# EAGLE design ESP-12 4-relay board USB power (EAGLE 9.6.2)

## Sheet 1 of 3
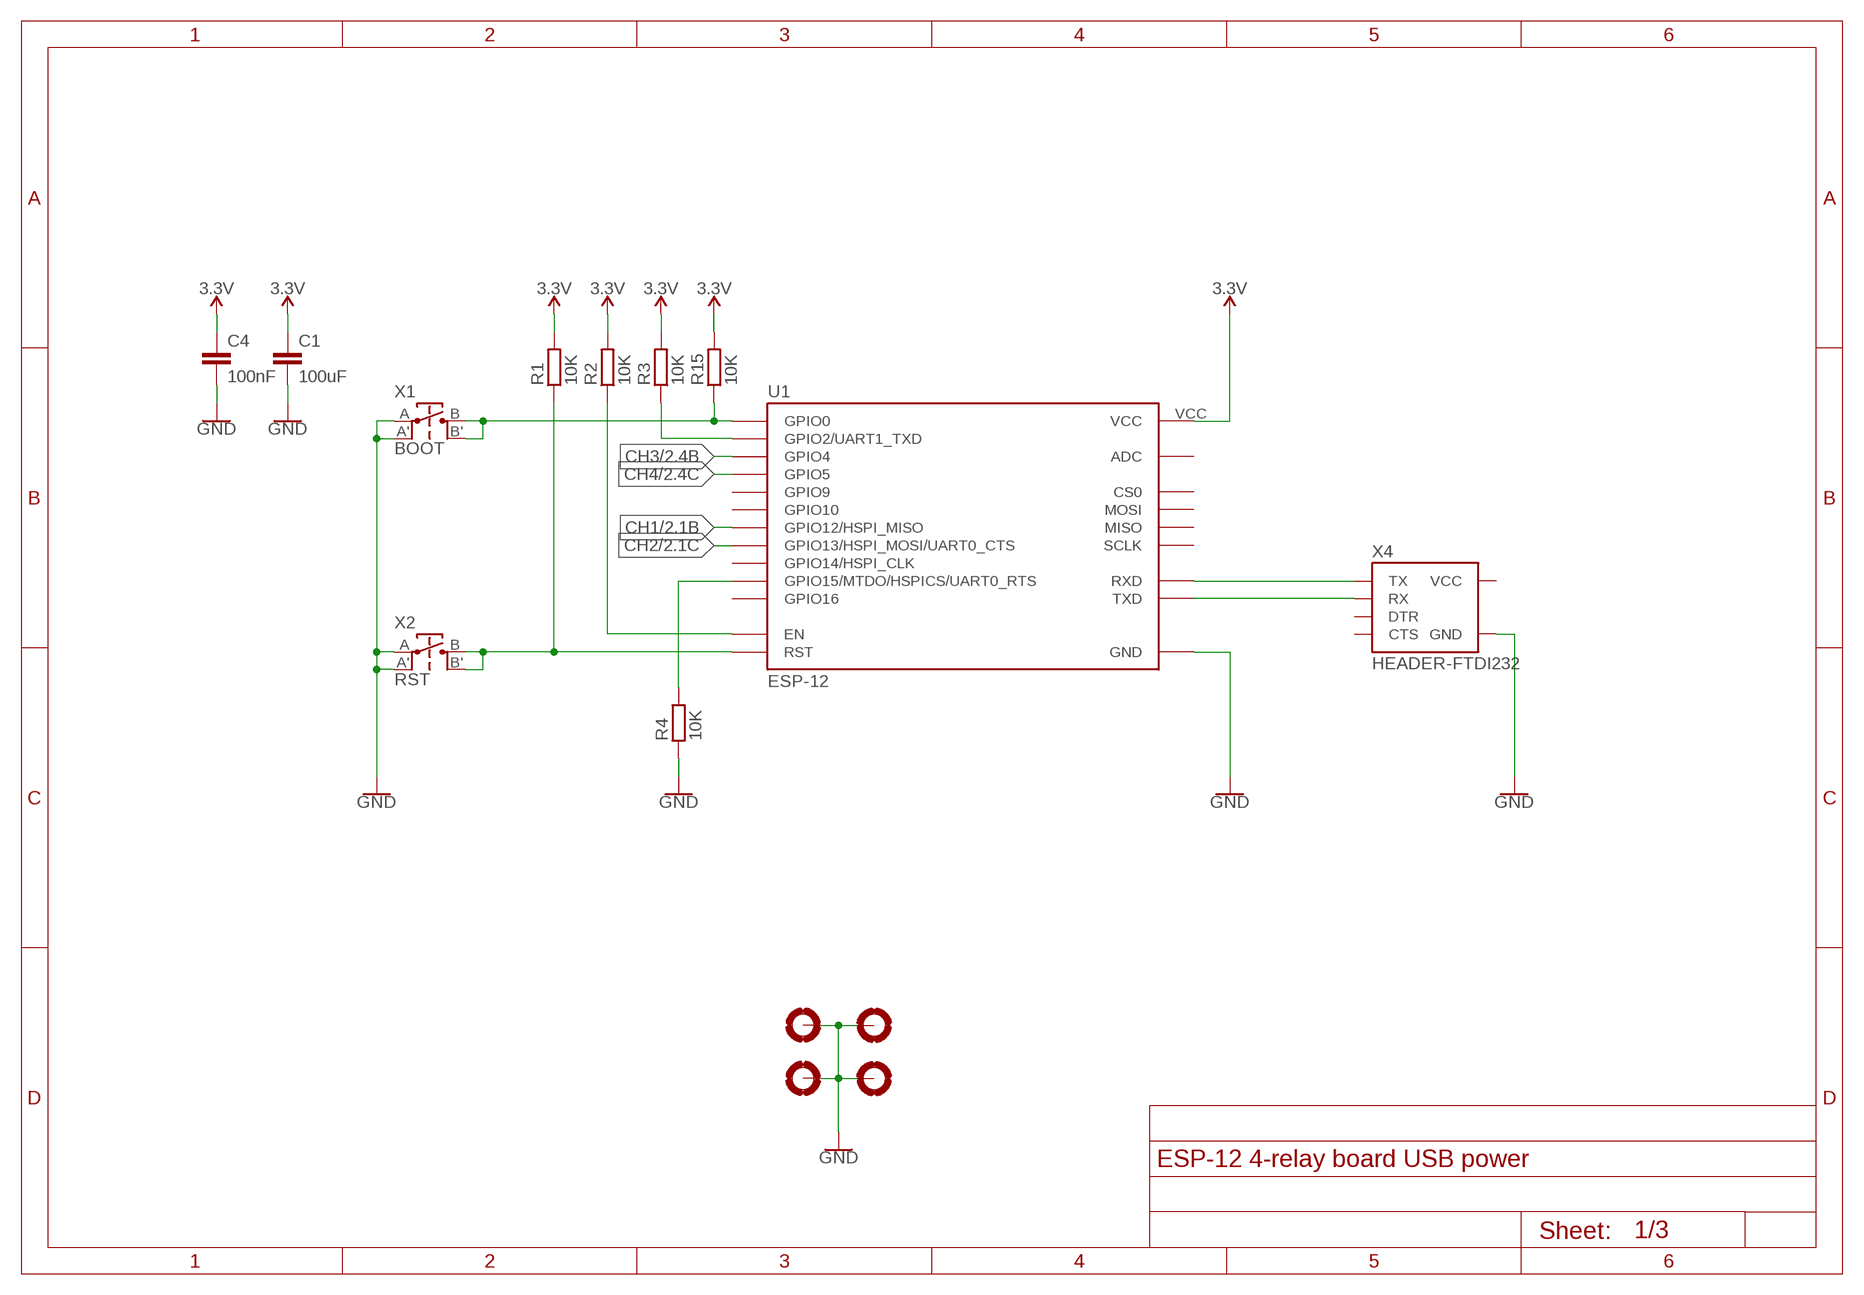
[diagram p0: schematic, sheet 1]

### Parts
C1  100uF  CAPC0603  [C0603]
C4  100nF  CAPC0603  [C0603]
H1  MOUNTHOLE-PAD3.2  [3.2-PAD]
H2  MOUNTHOLE-PAD3.2  [3.2-PAD]
H3  MOUNTHOLE-PAD3.2  [3.2-PAD]
H4  MOUNTHOLE-PAD3.2  [3.2-PAD]
R1  10K  RESISTOR0603  [R0603]
R2  10K  RESISTOR0603  [R0603]
R3  10K  RESISTOR0603  [R0603]
R4  10K  RESISTOR0603  [R0603]
R15  10K  RESISTOR0603  [R0603]
U1  ESP-12  ESP-12E  [ESP-12E]
X1  BOOT  TACT-SWITCHEVQ  [TACT-SWITCH-EVQ]
X2  RST  TACT-SWITCHEVQ  [TACT-SWITCH-EVQ]
X4  HEADER-FTDI232  [FTDI232-1X06]

### Nets
3.3V: C1.1 C4.1 R1.2 R2.2 R3.2 R15.2 U1.VCC ; also sheet 3
CH1: U1.GPIO12(GPIO12/HSPI_MISO) ; also sheet 2
CH2: U1.GPIO13(GPIO13/HSPI_MOSI/UART0_CTS) ; also sheet 2
CH3: U1.GPIO4 ; also sheet 2
CH4: U1.GPIO5 ; also sheet 2
GND: C1.2 C4.2 H1.B3,2(MOUNT) H2.B3,2(MOUNT) H3.B3,2(MOUNT) H4.B3,2(MOUNT) R4.1 U1.GND X1.A X1.A' X2.A X2.A' X4.GND ; also sheet 2,3
N$7: R4.2 U1.GPIO15(GPIO15/MTDO/HSPICS/UART0_RTS)
N$16: R2.1 U1.EN
N$19: R1.1 U1.RST X2.B X2.B'
N$22: R15.1 U1.GPIO0 X1.B X1.B'
N$24: R3.1 U1.GPIO2(GPIO2/UART1_TXD)
RXD: U1.RXD X4.TX
TXD: U1.TXD X4.RX
Unconnected: U1.ADC U1.CS0 U1.GPIO9 U1.GPIO10 U1.GPIO14(GPIO14/HSPI_CLK) U1.GPIO16 U1.MISO U1.MOSI U1.SCLK X4.CTS X4.DTR

## Sheet 2 of 3
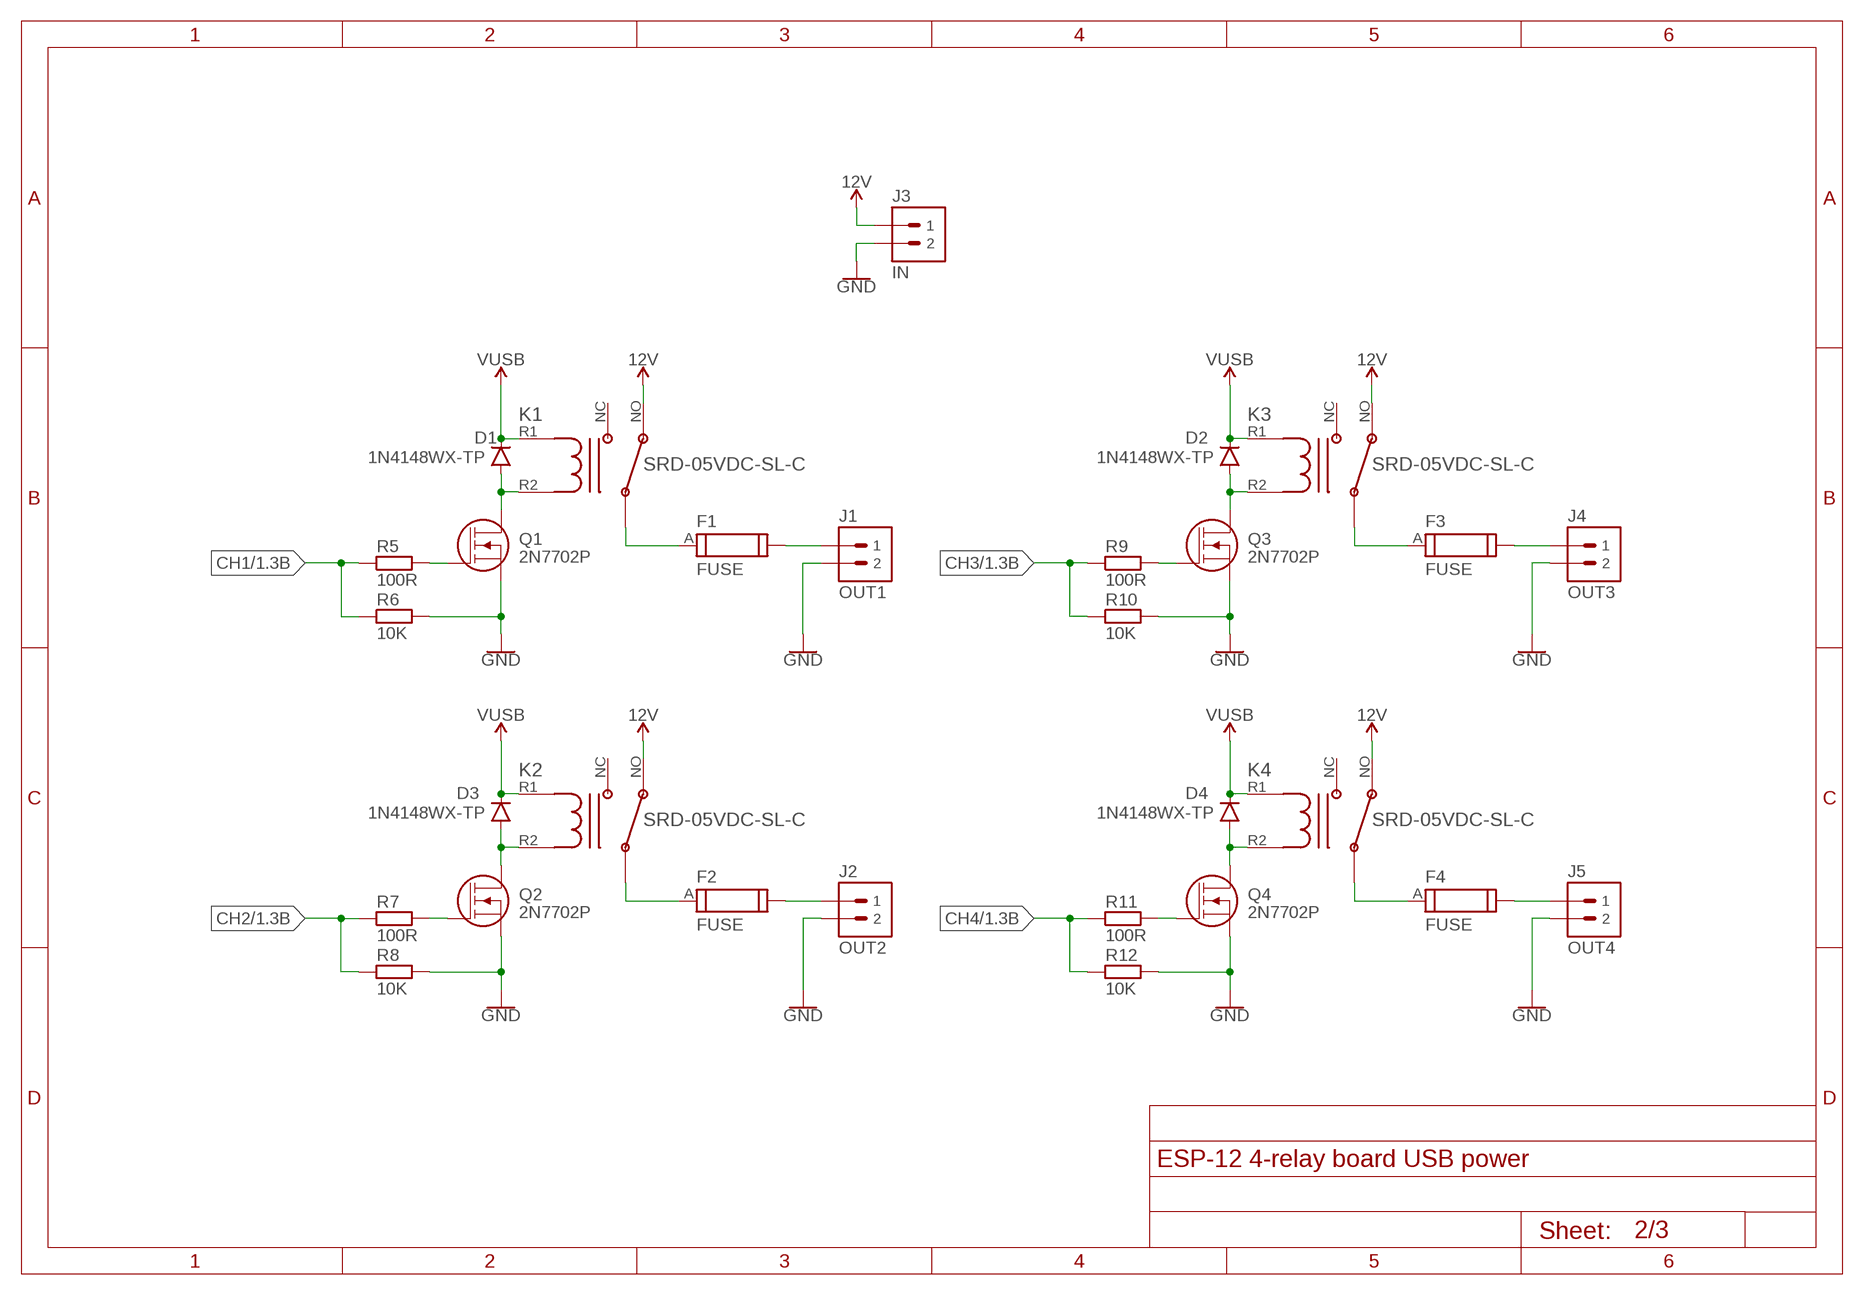
[diagram p1: schematic, sheet 2]

### Parts
D1  1N4148WX-TP  DIODE1N4148WX-TP  [SOD-323]
D2  1N4148WX-TP  DIODE1N4148WX-TP  [SOD-323]
D3  1N4148WX-TP  DIODE1N4148WX-TP  [SOD-323]
D4  1N4148WX-TP  DIODE1N4148WX-TP  [SOD-323]
F1  FUSE  FUSETEAL  [FUSE-TEAL]
F2  FUSE  FUSETEAL  [FUSE-TEAL]
F3  FUSE  FUSETEAL  [FUSE-TEAL]
F4  FUSE  FUSETEAL  [FUSE-TEAL]
J1  OUT1  TERMINAL-1X02-5.08OSTTC022162  [ONSHORE-OSTTC022162]
J2  OUT2  TERMINAL-1X02-5.08OSTTC022162  [ONSHORE-OSTTC022162]
J3  IN  TERMINAL-1X02-5.08OSTTC022162  [ONSHORE-OSTTC022162]
J4  OUT3  TERMINAL-1X02-5.08OSTTC022162  [ONSHORE-OSTTC022162]
J5  OUT4  TERMINAL-1X02-5.08OSTTC022162  [ONSHORE-OSTTC022162]
K1  SRD-05VDC-SL-C  RELAYSRD-05VDC-SL-C  [RELAY-SRD-05VDC-SL-C]
K2  SRD-05VDC-SL-C  RELAYSRD-05VDC-SL-C  [RELAY-SRD-05VDC-SL-C]
K3  SRD-05VDC-SL-C  RELAYSRD-05VDC-SL-C  [RELAY-SRD-05VDC-SL-C]
K4  SRD-05VDC-SL-C  RELAYSRD-05VDC-SL-C  [RELAY-SRD-05VDC-SL-C]
Q1  2N7702P  MOSFET-NCHSOT23-3  [SOT23-3]
Q2  2N7702P  MOSFET-NCHSOT23-3  [SOT23-3]
Q3  2N7702P  MOSFET-NCHSOT23-3  [SOT23-3]
Q4  2N7702P  MOSFET-NCHSOT23-3  [SOT23-3]
R5  100R  RESISTOR0603  [R0603]
R6  10K  RESISTOR0603  [R0603]
R7  100R  RESISTOR0603  [R0603]
R8  10K  RESISTOR0603  [R0603]
R9  100R  RESISTOR0603  [R0603]
R10  10K  RESISTOR0603  [R0603]
R11  100R  RESISTOR0603  [R0603]
R12  10K  RESISTOR0603  [R0603]

### Nets
12V: J3.1 K1.NO(NC) K2.NO(NC) K3.NO(NC) K4.NO(NC)
CH1: R5.1 R6.1 ; also sheet 1
CH2: R7.1 R8.1 ; also sheet 1
CH3: R9.1 R10.1 ; also sheet 1
CH4: R11.1 R12.1 ; also sheet 1
GND: J1.2 J2.2 J3.2 J4.2 J5.2 Q1.2(S) Q2.2(S) Q3.2(S) Q4.2(S) R6.2 R8.2 R10.2 R12.2 ; also sheet 1,3
N$1: D1.2(A) K1.R2 Q1.3(D)
N$2: F1.A K1.C
N$3: F1.B J1.1
N$4: Q1.1(G) R5.2
N$8: D3.2(A) K2.R2 Q2.3(D)
N$9: Q2.1(G) R7.2
N$10: F2.A K2.C
N$11: F2.B J2.1
N$12: D2.2(A) K3.R2 Q3.3(D)
N$13: F3.A K3.C
N$14: F3.B J4.1
N$15: Q3.1(G) R9.2
N$17: D4.2(A) K4.R2 Q4.3(D)
N$18: Q4.1(G) R11.2
N$20: F4.A K4.C
N$21: F4.B J5.1
VUSB: D1.1(C) D2.1(C) D3.1(C) D4.1(C) K1.R1 K2.R1 K3.R1 K4.R1 ; also sheet 3
Unconnected: K1.NC(NO) K2.NC(NO) K3.NC(NO) K4.NC(NO)

## Sheet 3 of 3
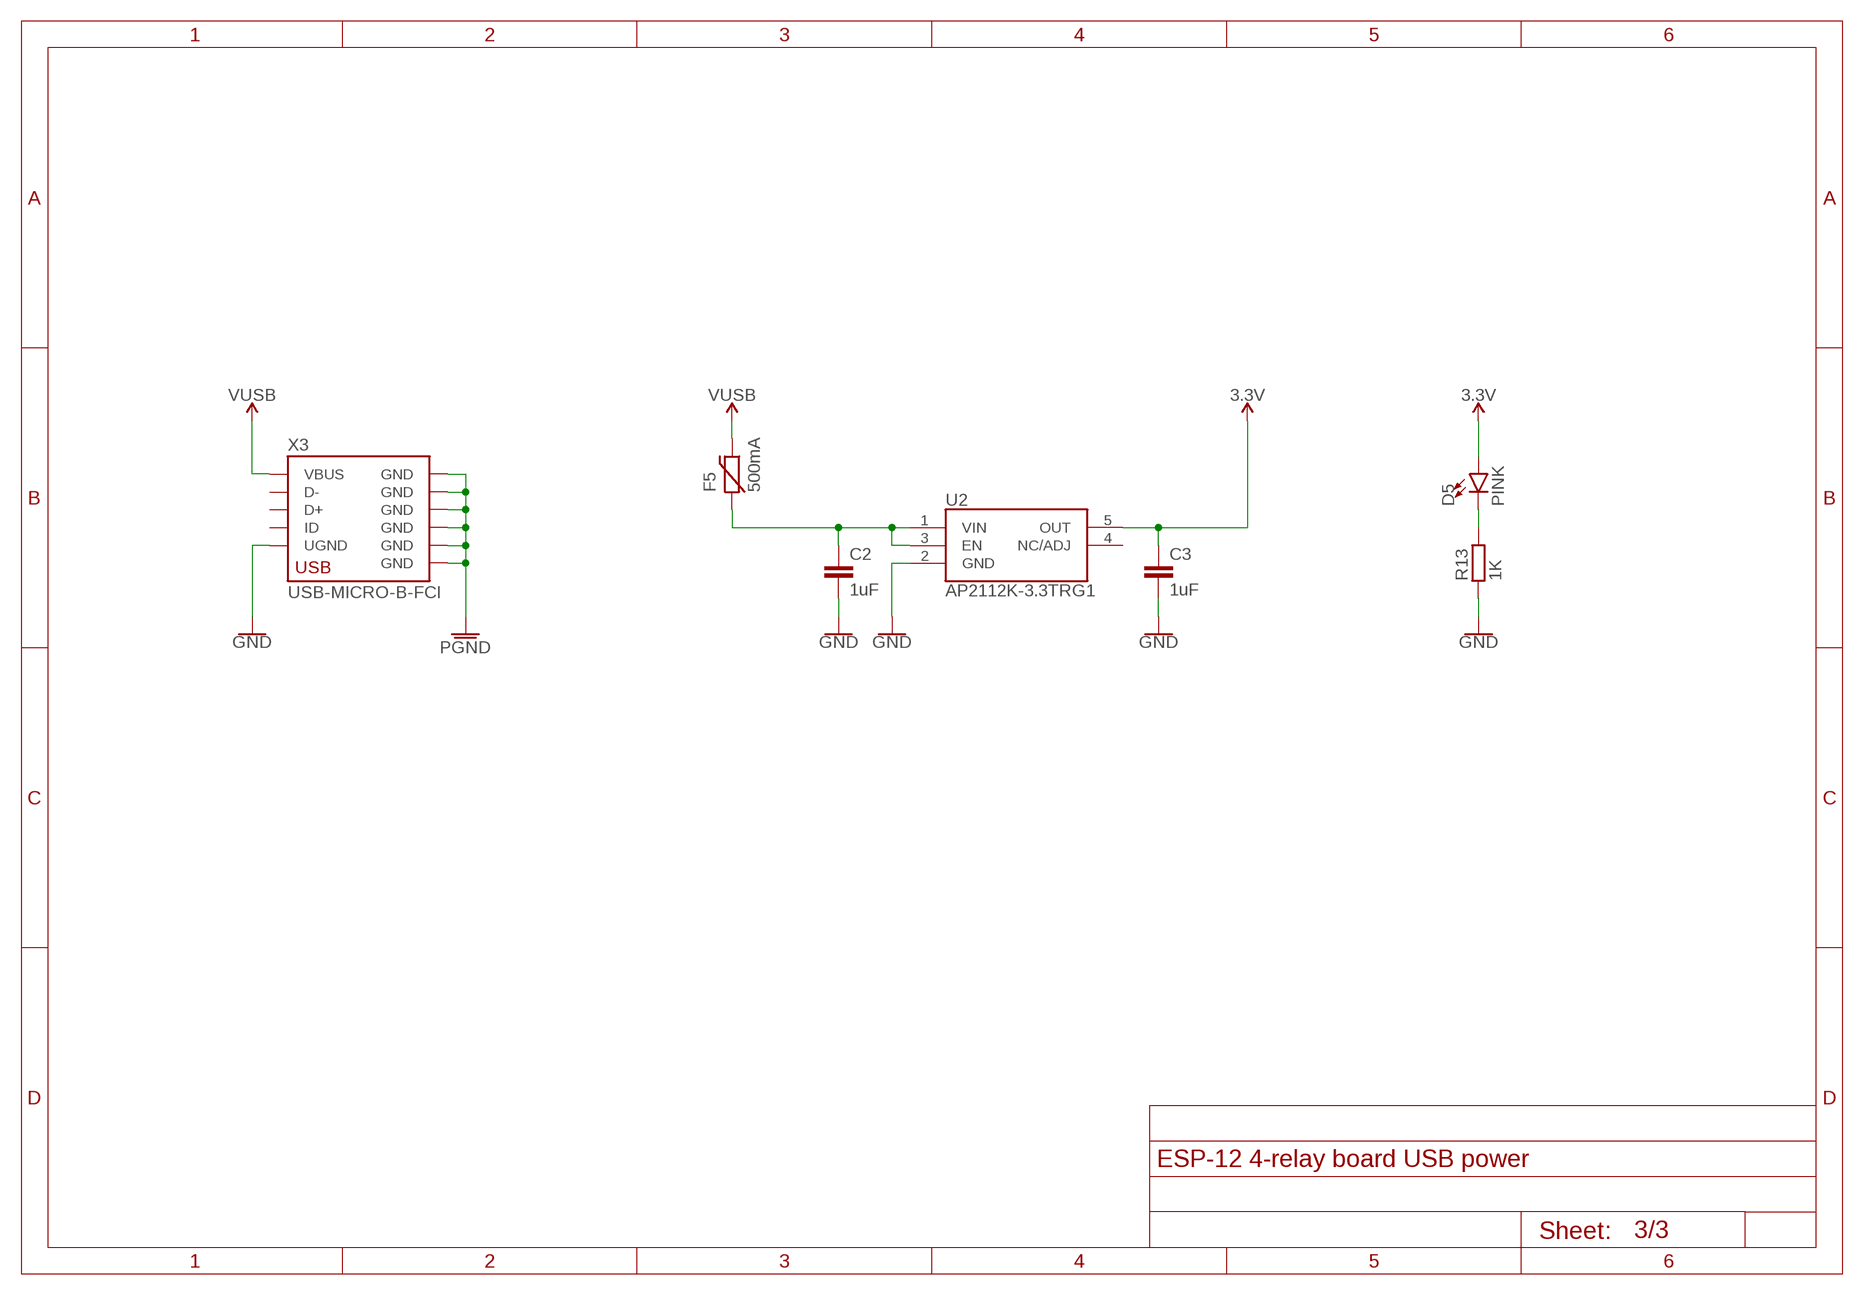
[diagram p2: schematic, sheet 3]

### Parts
C2  1uF  CAPC0603  [C0603]
C3  1uF  CAPC0603  [C0603]
D5  PINK  LED0603  [LED0603]
F5  500mA  PTC0ZCJ  [PTC-0ZCJ-1206]
R13  1K  RESISTOR0603  [R0603]
U2  AP2112K-3.3TRG1  REGULATOR-AP2112KK-SOT23-5  [SOT23-5]
X3  USB-MICRO-B-FCI  [USB-MICRO-B-FCI]

### Nets
3.3V: C3.1 D5.A U2.5(OUT) ; also sheet 1
GND: C2.2 C3.2 R13.1 U2.2(GND) X3.5(UGND) ; also sheet 1,2
N$5: D5.C R13.2
N$6: C2.1 F5.1 U2.1(VIN) U2.3(EN)
PGND: X3.GND@1(GND) X3.GND@2(GND) X3.GND@3(GND) X3.GND@4(GND) X3.GND@5(GND) X3.GND@6(GND)
VUSB: F5.2 X3.1(VBUS) ; also sheet 2
Unconnected: U2.4(NC/ADJ) X3.2(D-) X3.3(D+) X3.4(ID)

## Power pins joined to a net without a drawn wire
VCC: X4.VCC

## Library data of the parts
C1-C4 = M2M-Passives:CAP
D1-D4 = M2M-DiscreteSemi:DIODE
D5 = M2M-LED:LED: LED (Generic) Standard schematic elements and footprints for 5mm, 3mm, 1206, and 0603 sized LEDs. Generic LEDs with no color specified.
F1-F4 = M2M-Power:FUSE
F5 = M2M-Fuse:PTC
H1-H4 = M2M-Holes:MOUNTHOLE-PAD
J1-J5 = M2M-Connectors:TERMINAL-1X02-5.08: https://www.digikey.se/product-detail/sv/on-shore-technology-inc/OSTTC022162/ED2609-ND/614558
K1-K4 = M2M-Switches:RELAY
Q1-Q4 = M2M-DiscreteSemi:MOSFET-NCH
R1-R13 R15 = M2M-Passives:RESISTOR
U1 = M2M-Modules:ESP-12E
U2 = M2M-IC:REGULATOR-AP2112K
X1 X2 = M2M-Switches:TACT-SWITCH
X3 = M2M-Connectors:USB-MICRO-B-FCI: FCI-10118192-0001LF 609-4613-1-ND
X4 = M2M-Connectors:HEADER-FTDI232

## Board
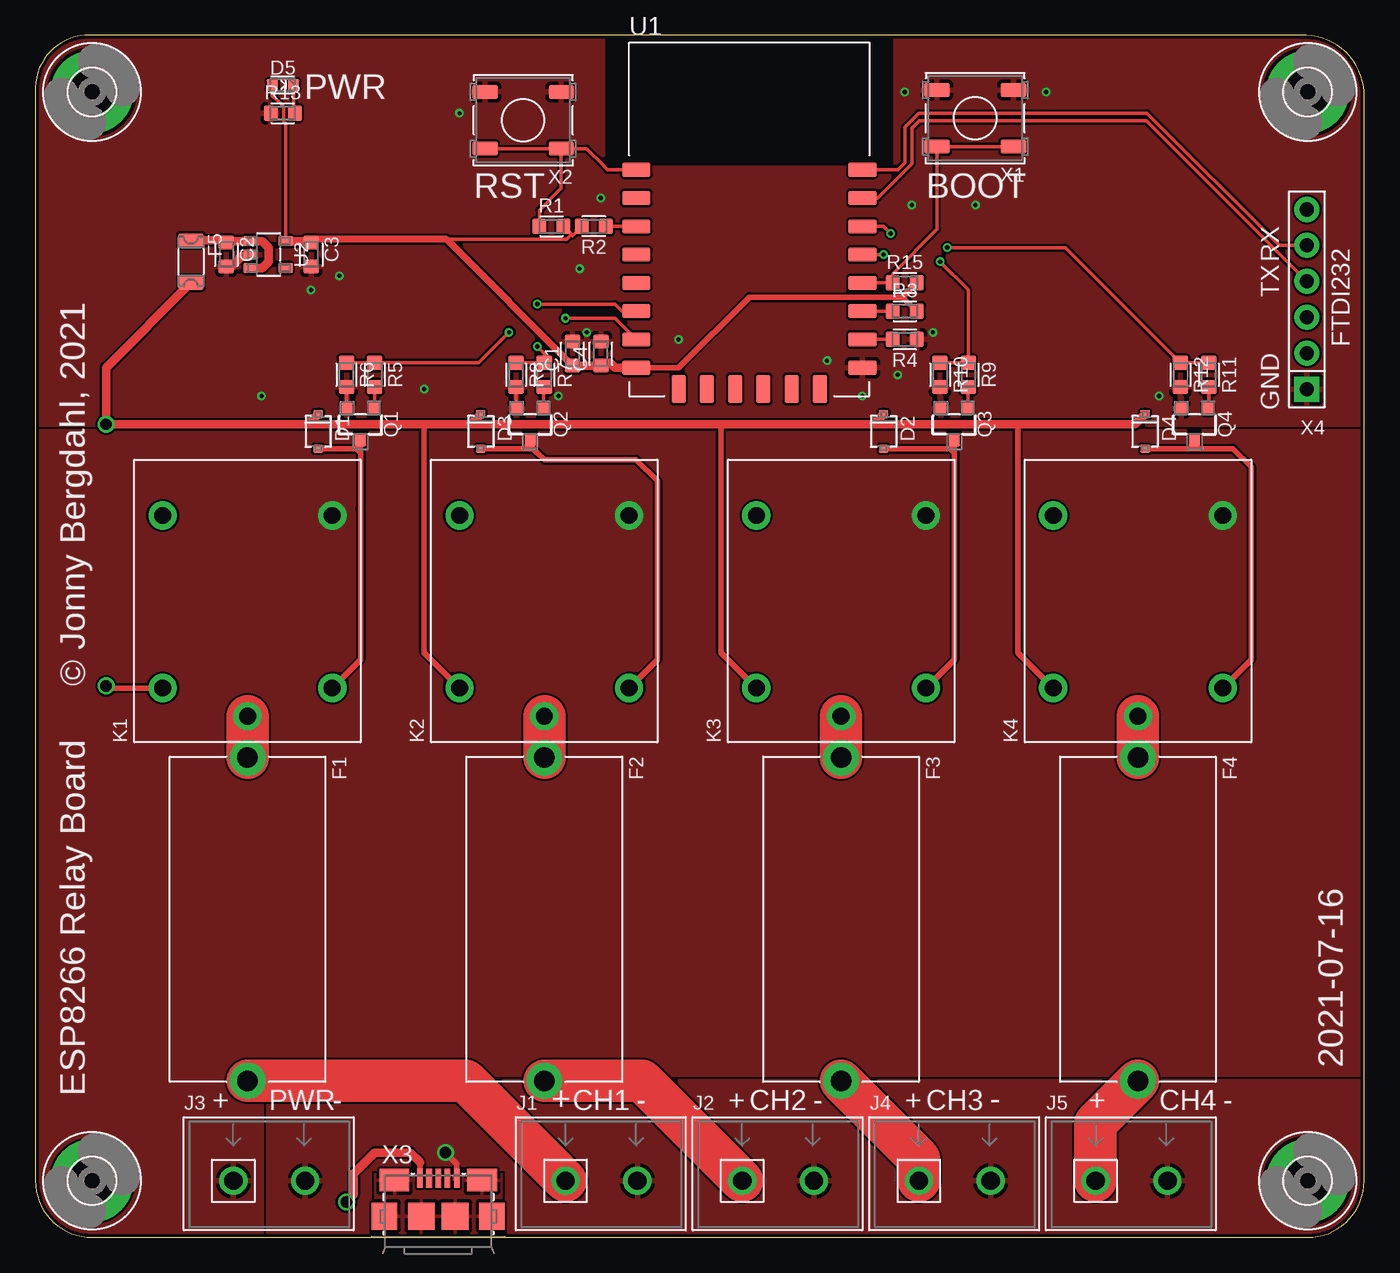
[diagram p3: board, top side]
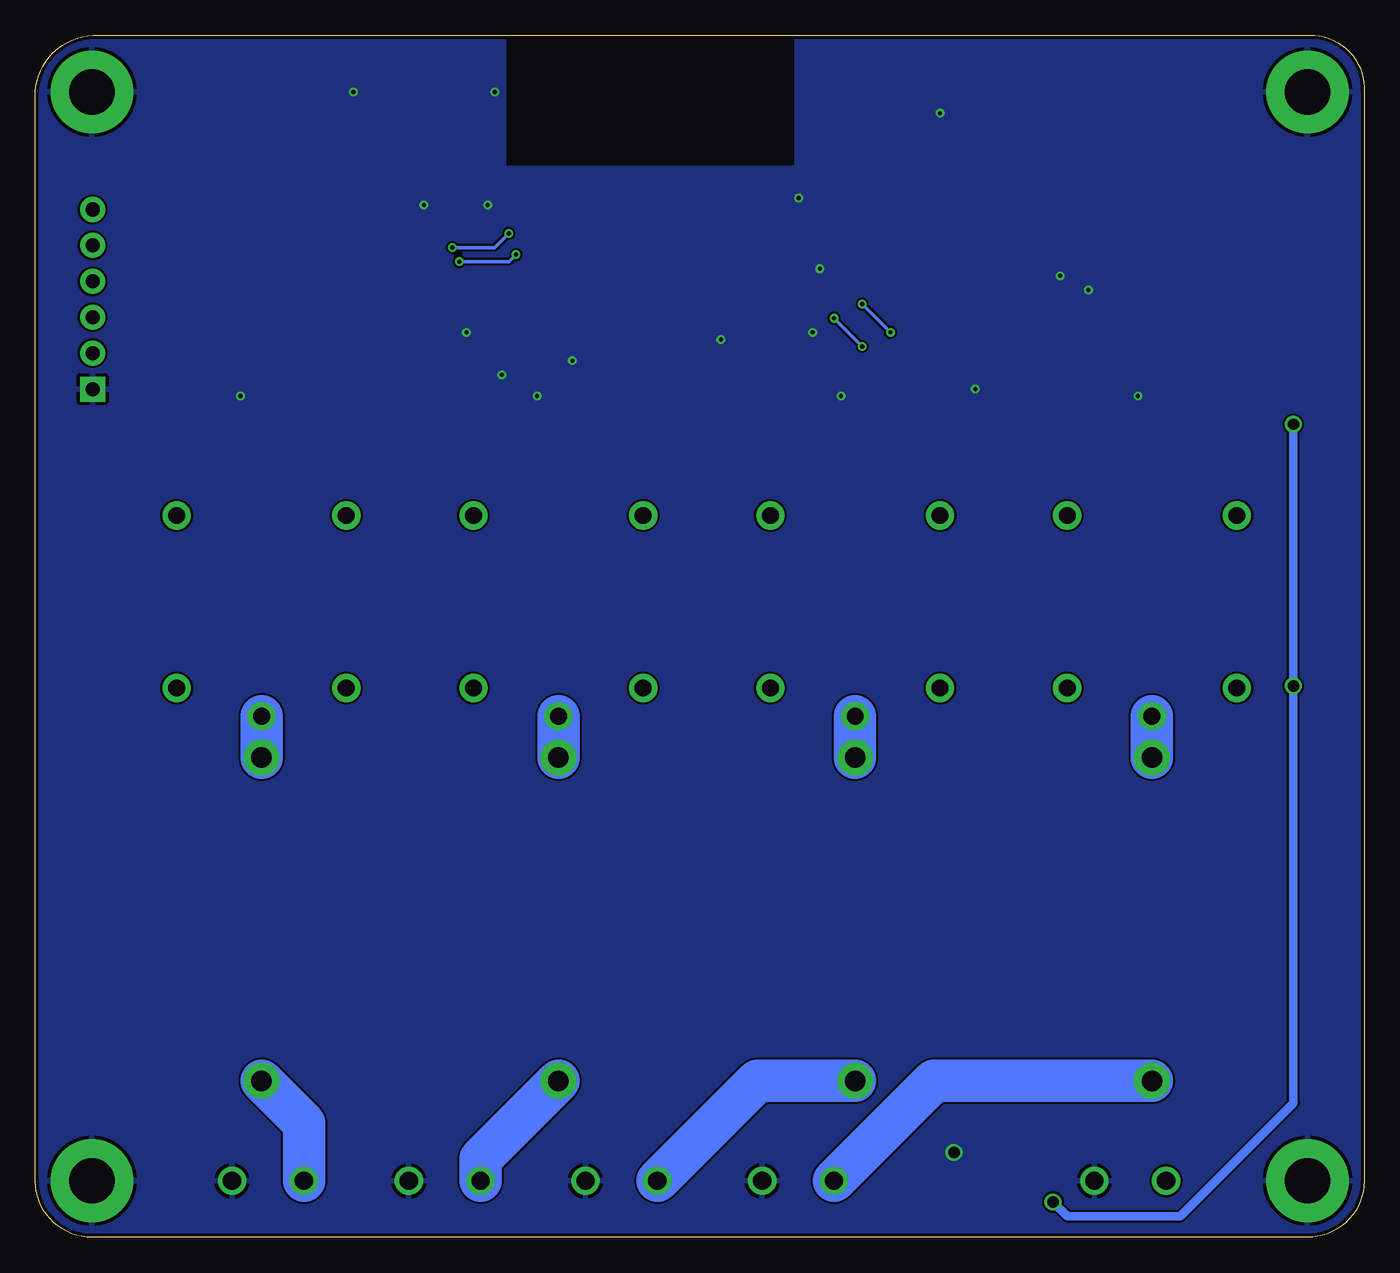
[diagram p4: board, bottom side, seen from below]

Size 94.01 x 85 mm. Coordinates in mm from the lower left corner, seen from the top.
Outline: 94.01,4 94.01,81 arc90 89.51,85 3.51,85 arc90 0.01,81 0.01,4 arc90 4.01,0 90.01,0 arc90 94.01,4
Copper layers (1*16): Top 0.035mm / dielectric 1.5mm / Bottom 0.035mm
Design rules "SeeedStudio_2layer_DRU_no_angle_20140221 *": minimum track width 6mil, minimum drill 0.3mm, track to track 6mil, track to pad 6mil, pad to pad 6mil, via to via 6mil, smd to smd 0mil, copper to edge 10mil, drill to drill 10mil, minimum pad ring 2mil, minimum via ring 6mil, stop-mask expansion 2mil, vias tented up to drill 1000mil, thermal gap 10mil

### Footprints (pad centres in the part's own frame; a part is rotated, then mirrored left to right if it is on the bottom)
C0603 = smd 1 x 1.1: 1 -0.85,0; 2 0.85,0
SOD-323 = smd 0.56 x 0.68: 1 -1.22,0; 2 1.22,0
LED0603 = smd 0.8 x 0.8: A -0.75,0; C 0.75,0
FUSE-TEAL = drill 1.45 pad 2.54: A -11.43,0; B 11.43,0
PTC-0ZCJ-1206 = smd 1 x 1.8: 1 -1.5,0; 2 1.5,0
3.2-PAD = drill 3.2 pad 5.842: B3,2 0,0
ONSHORE-OSTTC022162 = drill 1.3 pad 2: 1 0,0; 2 5.08,0
RELAY-SRD-05VDC-SL-C = drill 1.2 pad 2: C -8.15,0; NC 6.05,6; NO 6.05,-6; R1 -6.15,6; R2 -6.15,-6
SOT23-3 = smd 0.8 x 0.9: 1 -0.95,-1.1; 2 0.95,-1.1; 3 0,1.1
R0603 = smd 1 x 1.1: 1 -0.85,0; 2 0.85,0
ESP-12E = smd 2 x 1: ADC -8,1.5; EN -8,-0.5; GND 8,-10.5; GPIO0 8,-4.5; GPIO2 8,-6.5; GPIO4 8,-2.5; GPIO5 8,-0.5; GPIO12 -8,-6.5; GPIO13 -8,-8.5; GPIO14 -8,-4.5; GPIO15 8,-8.5; GPIO16 -8,-2.5; RST -8,3.5; RXD 8,1.5; TXD 8,3.5; VCC -8,-10.5 | smd 1 x 2: CS0 -5,-12; GPIO9 -1,-12; GPIO10 1,-12; MISO -3,-12; MOSI 3,-12; SCLK 5,-12
SOT23-5 = smd 0.7 x 1: 1 -0.95,-1.3; 2 0,-1.3; 3 0.95,-1.3; 4 0.95,1.2; 5 -0.95,1.2
TACT-SWITCH-EVQ = smd 1.8 x 1: A -2.7,-2; A' 2.7,-2; B -2.7,2; B' 2.7,2
USB-MICRO-B-FCI = smd 0.4 x 1.35: 1 -1.3,2.675; 2 -0.65,2.675; 3 0,2.675; 4 0.65,2.675; 5 1.3,2.675 | smd 2.1 x 1.6: GND@1 -3.1,2.55; GND@2 3.1,2.55 | smd 1.8 x 1.9: GND@3 -3.8,0; GND@6 3.8,0 | smd 1.9 x 1.9: GND@4 -1.2,0; GND@5 1.2,0
FTDI232-1X06 = drill 1 pad 1.778: CTS 0,3.81; DTR 0,-6.35; RX 0,-3.81; TX 0,-1.27; VCC 0,1.27 | drill 1 pad 1.778 square: GND 0,6.35

### Placement (x,y rotation side)
C1  38.01,62.5 90 top
C2  13.51,69.5 270 top
C3  19.51,69.5 270 top
C4  40.01,62.5 90 top
D1  20.01,57 270 top
D2  60.01,57 270 top
D3  31.51,57 270 top
D4  78.51,57 270 top
D5  17.51,81.5 0 top
F1  15.01,22.5 270 top
F2  36.01,22.5 270 top
F3  57.01,22.5 270 top
F4  78.01,22.5 270 top
F5  11.01,69 270 top
H1  4.01,4 0 top
H2  90.01,4 0 top
H3  4.01,81 0 top
H4  90.01,81 0 top
J1  37.51,4 0 top
J2  50.01,4 0 top
J3  14.01,4 0 top
J4  62.51,4 0 top
J5  75.01,4 0 top
K1  15.01,45 90 top
K2  36.01,45 90 top
K3  57.01,45 90 top
K4  78.01,45 90 top
Q1  23.01,57.5 180 top
Q2  35.01,57.5 180 top
Q3  65.01,57.5 180 top
Q4  82.01,57.5 180 top
R1  36.51,71.5 0 top
R2  39.51,71.5 180 top
R3  61.51,65.5 0 top
R4  61.51,63.5 180 top
R5  24.01,61 270 top
R6  22.01,61 270 top
R7  36.01,61 270 top
R8  34.01,61 270 top
R9  66.01,61 270 top
R10  64.01,61 270 top
R11  83.01,61 270 top
R12  81.01,61 270 top
R13  17.51,79.5 0 top
R15  61.51,67.5 0 top
U1  50.51,72 0 top
U2  16.51,69.5 270 top
X1  66.49,79.14 180 top
X2  34.51,79 180 top
X3  28.51,1.5 0 top
X4  89.96,66.34 180 top

### Tracks (layer width: path | path; a pad name or v marks a point on that pad's centre or on a via)
3.3V
  Top 0.254: R2.2 38.01,70.85 37.93,70.92 | R1.2 37.93,70.92 | D5.A 16.76,80.75 17.18,80.33 17.2,80.33 17.58,79.95 17.58,78.91 17.71,78.78 U2.5 | 37.93,70.92 37.58,70.58 29.08,70.58
  Top 0.406: 61.36,66.5 R3.2 | U1.VCC 45.51,61.5 50.51,66.5 61.36,66.5 | R15.2 61.36,66.5
  Top 0.508: C3.1 19.73,70.58 29.08,70.58 C1.1
  Top 0.61: U2.5 19.41,70.45 C3.1 | C1.1 C4.1 40.66,61.85 41.01,61.5 U1.VCC
12V
  pour Top (rank 5): 0.01,57.5 94.01,57.5 94.01,11 16.51,11 16.51,0 0.01,0
CH1  (via drill 0.3)
  Top 0.254: v33.51,64 31.36,61.85 R5.1 R6.1 | v35.51,66 41.01,66 41.51,65.5 U1.GPIO12
  Bottom 0.254: v33.51,64 v35.51,66
CH2  (via drill 0.3)
  Top 0.254: R8.1 R7.1 36.01,62.5 v35.51,63 | U1.GPIO13 41.01,65 v37.51,65
  Bottom 0.254: v37.51,65 v35.51,63
CH3  (via drill 0.3)
  Top 0.254: U1.GPIO4 v60.01,69.5 | R10.1 R9.1 66.01,67 v64.01,69
  Bottom 0.254: v60.01,69.5 60.51,69 v64.01,69
CH4  (via drill 0.3)
  Top 0.254: U1.GPIO5 60.01,71.5 v60.51,71 | v64.51,70 72.86,70 R12.1 R11.1
  Bottom 0.254: v60.51,71 61.51,70 v64.51,70
GND  (via drill 0.3, 0.8)
  Top 0.254: Q1.2 22.01,58.65 R6.2 | Q2.2 34.01,58.65 R8.2
  Top 0.406: X3.5 29.81,5.2 v29.01,6
  Top 0.61: U2.2 15.06,69.36 14.57,69.36 13.86,68.65 C2.2
  other vias: 45.51,63.5 56.01,62 63.51,64 62.01,73 66.51,73 58.51,59.5 79.51,59.5 37.01,59.5 16.01,59.5 39.01,64 30.01,79.5 21.51,68 19.51,67 40.01,73.5 38.51,68.5 27.51,60 61.01,61 71.51,81 61.51,81
  pour Bottom: 0.01,0 0.01,85 94.01,85 94.01,0
  pour Top: 0.01,57.5 94.01,57.5 94.01,85 0.01,85
  pour Top (rank 2): 16.51,0 16.51,11 94.01,11 94.01,0
N$1
  Top 0.406: 23.01,55.5 23.01,51.5 23.01,40.85 K1.R2 | Q1.3 23.01,55.5 | D1.2 22.73,55.78 23.01,55.5
N$2
  Top 3: K1.C F1.A
  Bottom 3: K1.C F1.A
N$3
  Top 3: F1.B 30.44,11.07 J1.1
  Bottom 3: F1.B 30.44,11.07 J1.1
N$4
  Top 0.254: Q1.1 24.01,58.65 R5.2
N$5
  Top 0.254: D5.C 18.26,79.6 R13.2
N$6
  Top 0.61: F5.1 13.36,70.5 13.41,70.45 | 13.41,70.45 C2.1 | 13.41,70.45 U2.1 16.06,70.45 16.51,70 16.51,69 16.06,68.55 U2.3
N$7
  Top 0.254: R4.2 U1.GPIO15
N$8
  Top 0.406: Q2.3 34.91,56.3 34.91,56.1 35.23,55.78 | K2.R2 44.01,40.85 44.01,53.5 42.51,55 36.01,55 35.51,55.5 35.23,55.78 | D3.2 35.23,55.78
N$9
  Top 0.254: R7.2 35.96,60.1 Q2.1
N$10
  Top 3: K2.C F2.A
  Bottom 3: K2.C F2.A
N$11
  Top 3: F2.B 42.94,11.07 J2.1
  Bottom 3: F2.B 42.94,11.07 J2.1
N$12
  Top 0.406: Q3.3 65.01,55.5 | 65.01,55.5 65.01,40.85 K3.R2 | D2.2 64.73,55.78 65.01,55.5
N$13
  Top 3: K3.C F3.A
  Bottom 3: K3.C F3.A
N$14
  Top 3: F3.B 62.51,5.57 J4.1
  Bottom 3: F3.B 62.51,5.57 J4.1
N$15
  Top 0.254: R9.2 65.96,60.1 Q3.1
N$16
  Top 0.254: R2.1 U1.EN
N$17
  Top 0.406: D4.2 82.01,55.78 | 82.01,55.78 84.73,55.78 86.01,54.5 86.01,40.85 K4.R2 | Q4.3 82.01,55.78
N$18
  Top 0.254: R11.2 83.01,58.65 Q4.1
N$19
  Top 0.254: X2.B' X2.B | U1.RST 40.48,75.5 40.22,75.76 40.22,75.79 39.01,77 X2.B | X2.B 37.21,74.2 35.66,72.65 R1.1
N$20
  Top 3: K4.C F4.A
  Bottom 3: K4.C F4.A
N$21
  Top 3: F4.B 75.01,8.07 J5.1
  Bottom 3: F4.B 75.01,8.07 J5.1
N$22
  Top 0.254: U1.GPIO0 R15.1 60.66,68.15 63.79,71.28 63.79,77 | 63.79,77 X1.B' | X1.B 63.93,77.14 63.79,77
N$24
  Top 0.254: U1.GPIO2 R3.1
PGND
  pour Top: 24.01,0 24.01,4.5 33.01,4.5 33.01,0
RXD
  Top 0.254: U1.RXD 59.58,73.5 62.01,75.92 62.01,78.42 62.54,78.96 78.6,78.96 X4.TX
TXD
  Top 0.254: U1.TXD 61.01,75.5 61.51,76 61.51,78.5 62.51,79.5 78.64,79.5 87.99,70.15 X4.RX
VUSB  (via drill 0.8)
  Top 0.406: K3.R1 48.51,41.35 48.51,57.5 | K2.R1 27.51,41.35 27.51,57.5 | K4.R1 69.51,41.35 69.51,57.5 | K1.R1 5.16,38.85 v5.01,39 | X3.1 27.21,5.3
  Top 0.61: F5.2 5.01,61.5 v5.01,57.5 19.29,57.5 | 59.29,57.5 48.51,57.5 31.01,57.5 | D4.1 77.79,57.5 69.51,57.5 59.29,57.5 | D1.1 19.29,57.5 | D2.1 59.29,57.5 | 27.21,5.3 26.51,6 24.01,6 22.51,4.5 22.51,3 v22.01,2.5 | 31.01,57.5 27.51,57.5 19.29,57.5 | D3.1 31.01,57.72 31.01,57.5
  Bottom 0.61: v5.01,57.5 v5.01,39 5.01,9.5 13.01,1.5 21.01,1.5 v22.01,2.5

### Text on the board
tPlace: PWR | RST | BOOT | RX | TX | FTDI232 | GND | © Jonny Bergdahl, 2021 | 2021-07-16 | ESP8266 Relay Board | + | PWR | - | + | CH1 | - | + | CH2 | - | + | CH3 | - | + | CH4 | -